# EAGLE design CAN-Bus (EAGLE 6.2)
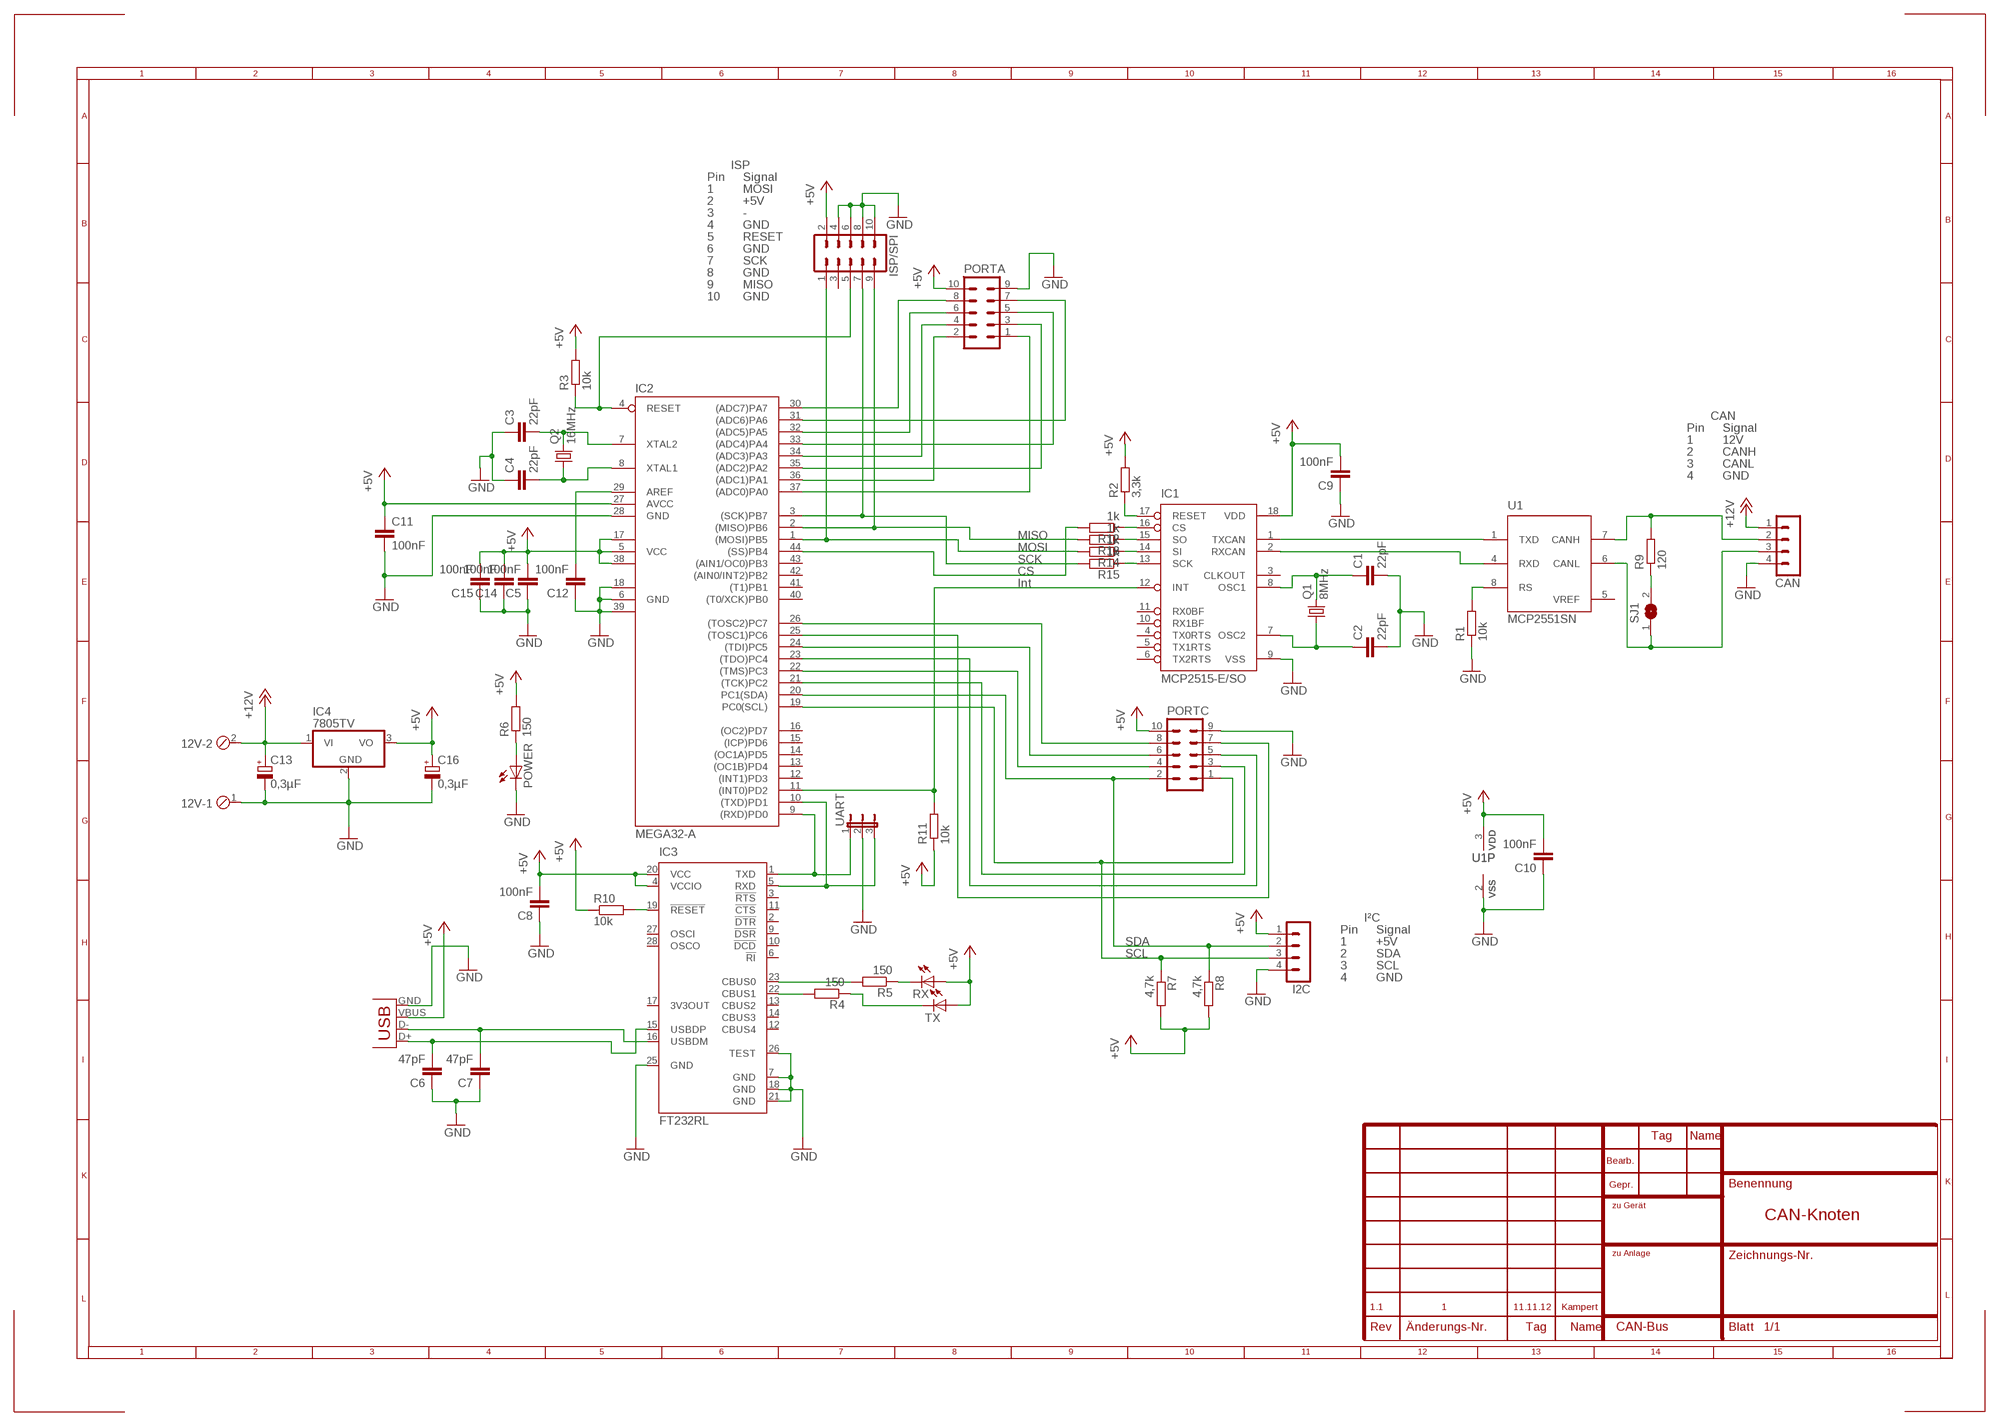
[diagram p0: schematic, sheet 1]

## Parts
12V  MPT2  [2POL254]
C1  22pF  C-EUC0805  [C0805]
C2  22pF  C-EUC0805  [C0805]
C3  22pF  C-EUC0805  [C0805]
C4  22pF  C-EUC0805  [C0805]
C5  100nF  C-EUC0805  [C0805]
C6  47pF  C-EUC0805  [C0805]
C7  47pF  C-EUC0805  [C0805]
C8  100nF  C-EUC0805  [C0805]
C9  100nF  C-EUC0805  [C0805]
C10  100nF  C-EUC0805  [C0805]
C11  100nF  C-EUC0805  [C0805]
C12  100nF  C-EUC0805  [C0805]
C13  0,3µF  CPOL-EU153CLV-0405  [153CLV-0405]
C14  100nF  C-EUC0805  [C0805]
C15  100nF  C-EUC0805  [C0805]
C16  0,3µF  CPOL-EU153CLV-0405  [153CLV-0405]
CAN  MA04-1  [MA04-1]
I2C  MA04-1  [MA04-1]
IC1  MCP2515-E/SO  [SO18L]
IC2  MEGA32-A  [TQFP44]
IC3  FT232RL  [SSOP28]
IC4  7805TV  [TO220V]
ISP/SPI  ML10  [ML10]
PORTA  ML10  [ML10]
PORTC  ML10  [ML10]
POWER  LEDCHIP-LED0805  [CHIP-LED0805]
Q1  8MHz  CRYSTALHC49UP  [HC49UP]
Q2  16MHz  CRYSTALHC49UP  [HC49UP]
R1  10k  R-EU_M0805  [M0805]
R2  3,3k  R-EU_M0805  [M0805]
R3  10k  R-EU_M0805  [M0805]
R4  150  R-EU_M0805  [M0805]
R5  150  R-EU_M0805  [M0805]
R6  150  R-EU_M0805  [M0805]
R7  4,7k  R-EU_M0805  [M0805]
R8  4,7k  R-EU_M0805  [M0805]
R9  120  R-EU_M0805  [M0805]
R10  10k  R-EU_M0805  [M0805]
R11  10k  R-EU_M0805  [M0805]
R12  1k  R-EU_R0402  [R0402]
R13  1k  R-EU_R0402  [R0402]
R14  1k  R-EU_R0402  [R0402]
R15  1k  R-EU_R0402  [R0402]
RX  LEDCHIP-LED0805  [CHIP-LED0805]
SJ1  SJ  [SJ]
TX  LEDCHIP-LED0805  [CHIP-LED0805]
U1  MCP2551SN  [SO-08]
UART  JP2E  [JP2]
X1  USB-B-H  [USB-B-H]

## Nets
+5V: C5.2 C8.2 C9.2 C10.2 C11.1 C14.2 C15.2 C16.+ I2C.1 IC1.18(VDD) IC2.5(VCC) IC2.17(VCC1) IC2.27(AVCC) IC2.38(VCC2) IC3.4(VCCIO) IC3.20(VCC) IC4.3(VO) ISP/SPI.2 PORTA.10 PORTC.10 R2.2 R3.2 R6.2 R7.2 R8.2 R10.1 R11.1 RX.A TX.A U1.3(VDD) X1.VBUS
+12V: 12V.2 C13.+ CAN.1 IC4.1(VI)
CANH: CAN.2 R9.2 U1.7(CANH)
CANL: CAN.3 SJ1.1 U1.6(CANL)
CHIPSELECT: IC2.44((SS)PB4) R12.2
D+: C6.2 IC3.15(USBDP) X1.D+
D-: C7.2 IC3.16(USBDM) X1.D-
GND: 12V.1 C1.2 C2.2 C3.1 C4.1 C5.1 C6.1 C7.1 C8.1 C9.1 C10.1 C11.2 C12.1 C13.- C14.1 C15.1 C16.- CAN.4 I2C.4 IC1.9(VSS) IC2.6(GND) IC2.18(GND1) IC2.28(GND) IC2.39(GND2) IC3.7(GND) IC3.18(GND) IC3.21(GND) IC3.25(GND) IC3.26(TEST) IC4.2(GND) ISP/SPI.4 ISP/SPI.6 ISP/SPI.8 ISP/SPI.10 PORTA.9 PORTC.9 POWER.C R1.1 U1.2(VSS) UART.2 X1.GND
MISO: IC2.2((MISO)PB6) ISP/SPI.9 R13.2
MOSI: IC2.1((MOSI)PB5) ISP/SPI.1 R14.2
N$4: C4.2 IC2.8(XTAL1) Q2.1
N$5: R1.2 U1.8(RS)
N$6: C3.2 IC2.7(XTAL2) Q2.2
N$7: IC3.23(CBUS0) R5.2
N$8: IC1.1(TXCAN) U1.1(TXD)
N$9: IC1.2(RXCAN) U1.4(RXD)
N$10: C2.1 IC1.7(OSC2) Q1.1
N$11: C1.1 IC1.8(OSC1) Q1.2
N$13: IC1.17(RESET) R2.1
N$15: R4.1 TX.C
N$16: R5.1 RX.C
N$17: IC3.22(CBUS1) R4.2
N$18: IC2.37((ADC0)PA0) PORTA.1
N$19: IC2.36((ADC1)PA1) PORTA.2
N$20: IC2.35((ADC2)PA2) PORTA.3
N$21: IC2.34((ADC3)PA3) PORTA.4
N$22: IC2.33((ADC4)PA4) PORTA.5
N$23: IC2.32((ADC5)PA5) PORTA.6
N$24: IC2.31((ADC6)PA6) PORTA.7
N$25: IC2.30((ADC7)PA7) PORTA.8
N$26: IC1.12(INT) IC2.11((INT0)PD2) R11.2
N$29: IC2.21((TCK)PC2) PORTC.3
N$30: IC2.22((TMS)PC3) PORTC.4
N$31: IC2.23((TDO)PC4) PORTC.5
N$32: IC2.24((TDI)PC5) PORTC.6
N$33: IC2.25((TOSC1)PC6) PORTC.7
N$34: IC2.26((TOSC2)PC7) PORTC.8
N$35: POWER.A R6.1
N$37: IC3.19(!RESET) R10.2
N$38: C12.2 IC2.29(AREF)
N$39: R9.1 SJ1.2
N$40: IC1.13(SCK) R15.1
N$41: IC1.14(SI) R14.1
N$42: IC1.15(SO) R13.1
N$43: IC1.16(CS) R12.1
RESET: IC2.4(RESET) ISP/SPI.5 R3.1
RX: IC2.9((RXD)PD0) IC3.1(TXD) UART.1
SCK: IC2.3((SCK)PB7) ISP/SPI.7 R15.2
SCL: I2C.3 IC2.19(PC0(SCL)) PORTC.1 R7.1
SDA: I2C.2 IC2.20(PC1(SDA)) PORTC.2 R8.1
TX: IC2.10((TXD)PD1) IC3.5(RXD) UART.3
Unconnected: IC1.3(CLKOUT) IC1.4(TX0RTS) IC1.5(TX1RTS) IC1.6(TX2RTS) IC1.10(RX1BF) IC1.11(RX0BF) IC2.12((INT1)PD3) IC2.13((OC1B)PD4) IC2.14((OC1A)PD5) IC2.15((ICP)PD6) IC2.16((OC2)PD7) IC2.40((T0/XCK)PB0) IC2.41((T1)PB1) IC2.42((AIN0/INT2)PB2) IC2.43((AIN1/OC0)PB3) IC3.2(!DTR) IC3.3(!RTS) IC3.6(!RI) IC3.9(!DSR) IC3.10(!DCD) IC3.11(!CTS) IC3.12(CBUS4) IC3.13(CBUS2) IC3.14(CBUS3) IC3.17(3V3OUT) IC3.27(OSCI) IC3.28(OSCO) ISP/SPI.3

## Notes on the sheet
- ISP
- Pin | Signal
- 1 | MOSI
- 2 | +5V
- 3 | -
- 4 | GND
- 5 | RESET
- 6 | GND
- 7 | SCK
- 8 | GND
- 9 | MISO
- 10 | GND
- CAN
- Pin | Signal
- 1 | 12V
- 2 | CANH
- 3 | CANL
- 4 | GND
- MISO
- MOSI
- SCK
- CS
- Int
- I²C
- Pin | Signal
- SDA | 1 | +5V
- SCL | 2 | SDA
- 3 | SCL
- 4 | GND
- CAN-Knoten
- 1.1 | 1 | 11.11.12 | Kampert

## Power pins joined to a net without a drawn wire
VREF: U1.5(VREF)

## Library data of the parts
12V = con-phoenix-254:MPT2: PHOENIX CONNECTOR; OC_FARNELL: unknown; OC_NEWARK: unknown
C1-C12 C14 C15 = rcl:C-EU: CAPACITOR, European symbol
C13 C16 = rcl:CPOL-EU: POLARIZED CAPACITOR, European symbol
CAN I2C = con-lstb:MA04-1: PIN HEADER; OC_FARNELL: unknown; OC_NEWARK: unknown
IC1 = mcp2515:MCP2515
IC2 = atmel:MEGA32: MICROCONTROLLER 32 Kbytes FLASH 2 Kbytes SRAM 1 Kbytes EEPROM USART 8-channel 10 bit ADC Source: www.atmel.com .. doc2503.pdf; MPN: ATMEGA32-16AU; OC_FARNELL: 9171274; OC_NEWARK: 69K6677
IC3 = ftdichip:FT232R: Source: http://www.ftdichip.com/Documents/DataSheets/DS_FT232R_v104.pdf; MPN: FT232RL; OC_FARNELL: 1146032; OC_NEWARK: 91K9918
IC4 = linear:78*: Positive VOLTAGE REGULATOR Source: http://cache.national.com/ds/LM/LM78L05.pdf http://www.fairchildsemi.com/ds/LM/LM7805.pdf
ISP/SPI PORTA PORTC = con-harting-ml:ML10: HARTING; OC_FARNELL: unknown; OC_NEWARK: unknown
POWER RX TX = led:LED: LED OSRAM: - CHIPLED LG R971, LG N971, LY N971, LG Q971, LY Q971, LO R971, LY R971 LH N974, LH R974 LS Q976, LO Q976, LY Q976 LO Q996 - Hyper CHIPLED LW Q18S LB Q993, LB Q99A, LB R99A - SideLED LS A670, LO A670, LY A670, LG A670, LP A670 LB A673, LV A673, LT A673, LW A673 LH A674 LY A675 LS A676, LA A676, LO A676, LY A676, LW A676 LS A679, LY A679, LG A679 - Hyper Micro SIDELED® LS Y876, LA Y876, LO Y876, LY Y876 LT Y87S - SmartLED LW L88C, LW L88S LB L89C, LB L89S, LG L890 LS L89K, LO L89K, LY L89K LS L896, LA L896, LO L896, LY L896 - TOPLED LS T670, LO T670, LY T670, LG T670, LP T670 LSG T670, LSP T670, LSY T670, LOP T670, LYG T670 LG T671, LOG T671, LSG T671 LB T673, LV T673, LT T673, LW T673 LH T674 LS T676, LA T676, LO T676, LY T676, LB T676, LH T676, LSB T676, LW T676 LB T67C, LV T67C, LT T67C, LS T67K, LO T67K, LY T67K, LW E67C LS E67B, LA E67B, LO E67B, LY E67B, LB E67C, LV E67C, LT E67C LW T67C LS T679, LY T679, LG T679 LS T770, LO T770, LY T770, LG T770, LP T770 LB T773, LV T773, LT T773, LW T773 LH T774 LS E675, LA E675, LY E675, LS T675 LS T776, LA T776, LO T776, LY T776, LB T776 LHGB T686 LT T68C, LB T68C - Hyper Mini TOPLED® LB M676 - Mini TOPLED Santana® LG M470 LS M47K, LO M47K, LY M47K Source: http://www.osram.convergy.de LUXEON: - LUMILED® LXK2-PW12-R00, LXK2-PW12-S00, LXK2-PW14-U00, LXK2-PW14-V00 LXK2-PM12-R00, LXK2-PM12-S00, LXK2-PM14-U00 LXK2-PE12-Q00, LXK2-PE12-R00, LXK2-PE12-S00, LXK2-PE14-T00, LXK2-PE14-U00 LXK2-PB12-K00, LXK2-PB12-L00, LXK2-PB12-M00, LXK2-PB14-N00, LXK2-PB14-P00, LXK2-PB14-Q00 LXK2-PR12-L00, LXK2-PR12-M00, LXK2-PR14-Q00, LXK2-PR14-R00 LXK2-PD12-Q00, LXK2-PD12-R00, LXK2-PD12-S00 LXK2-PH12-R00, LXK2-PH12-S00 LXK2-PL12-P00, LXK2-PL12-Q00, LXK2-PL12-R00 Source: www.luxeon.com KINGBRIGHT: KA-3528ASYC Source: www.kingbright.com
Q1 Q2 = crystal:CRYSTAL: CRYSTAL; OC_FARNELL: unknown; OC_NEWARK: unknown
R1-R15 = rcl:R-EU_: RESISTOR, European symbol
SJ1 = jumper:SJ: SMD solder JUMPER
U1 = microchip_can:MCP2551: High Speed CAN tranceiver
UART = jumper:JP2E: JUMPER
X1 = con-usb:USB: USB Connectors

## Board
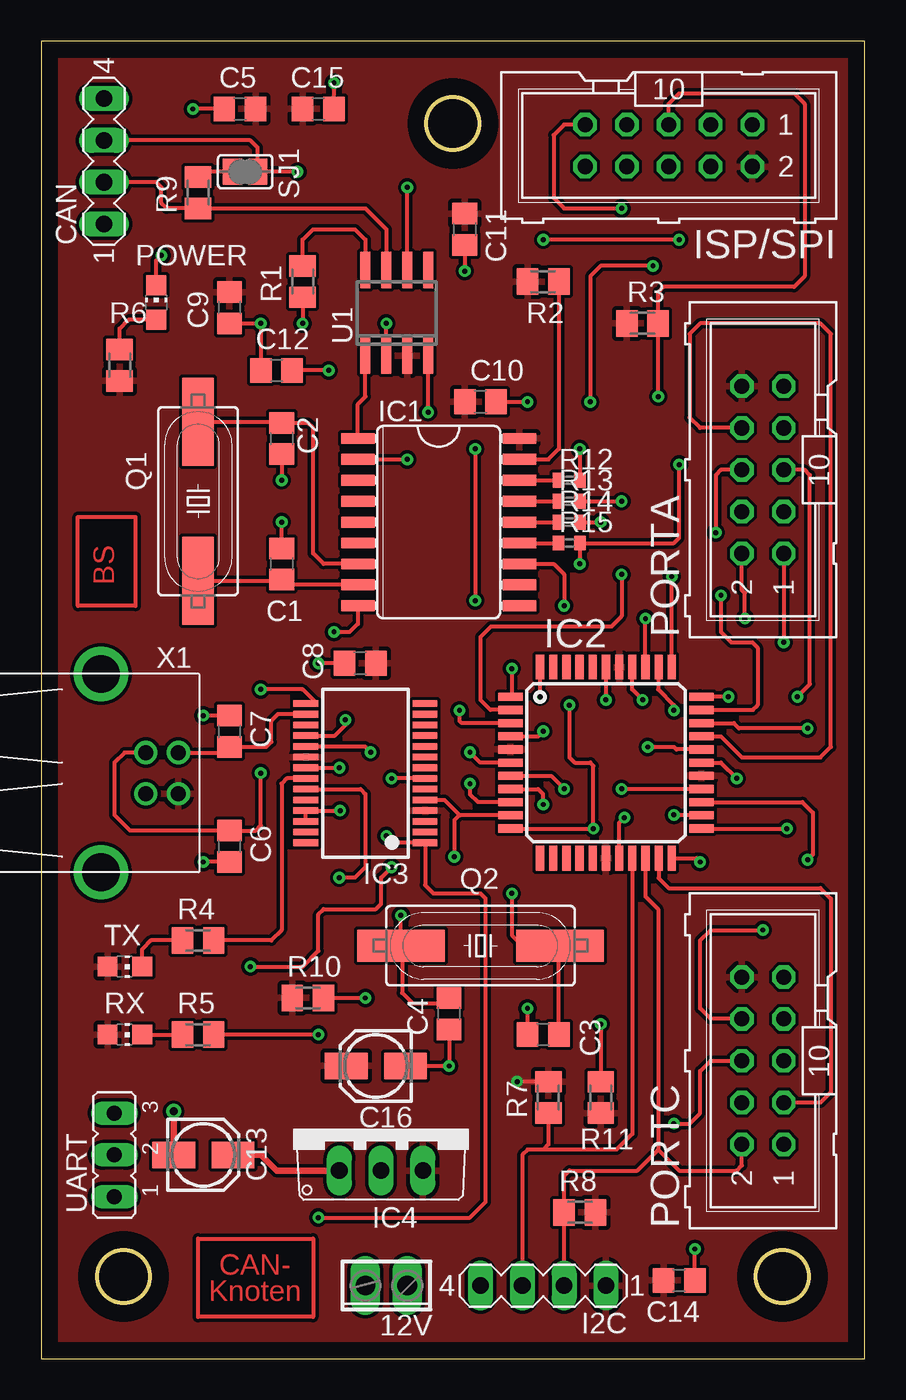
[diagram p1: board, top side]
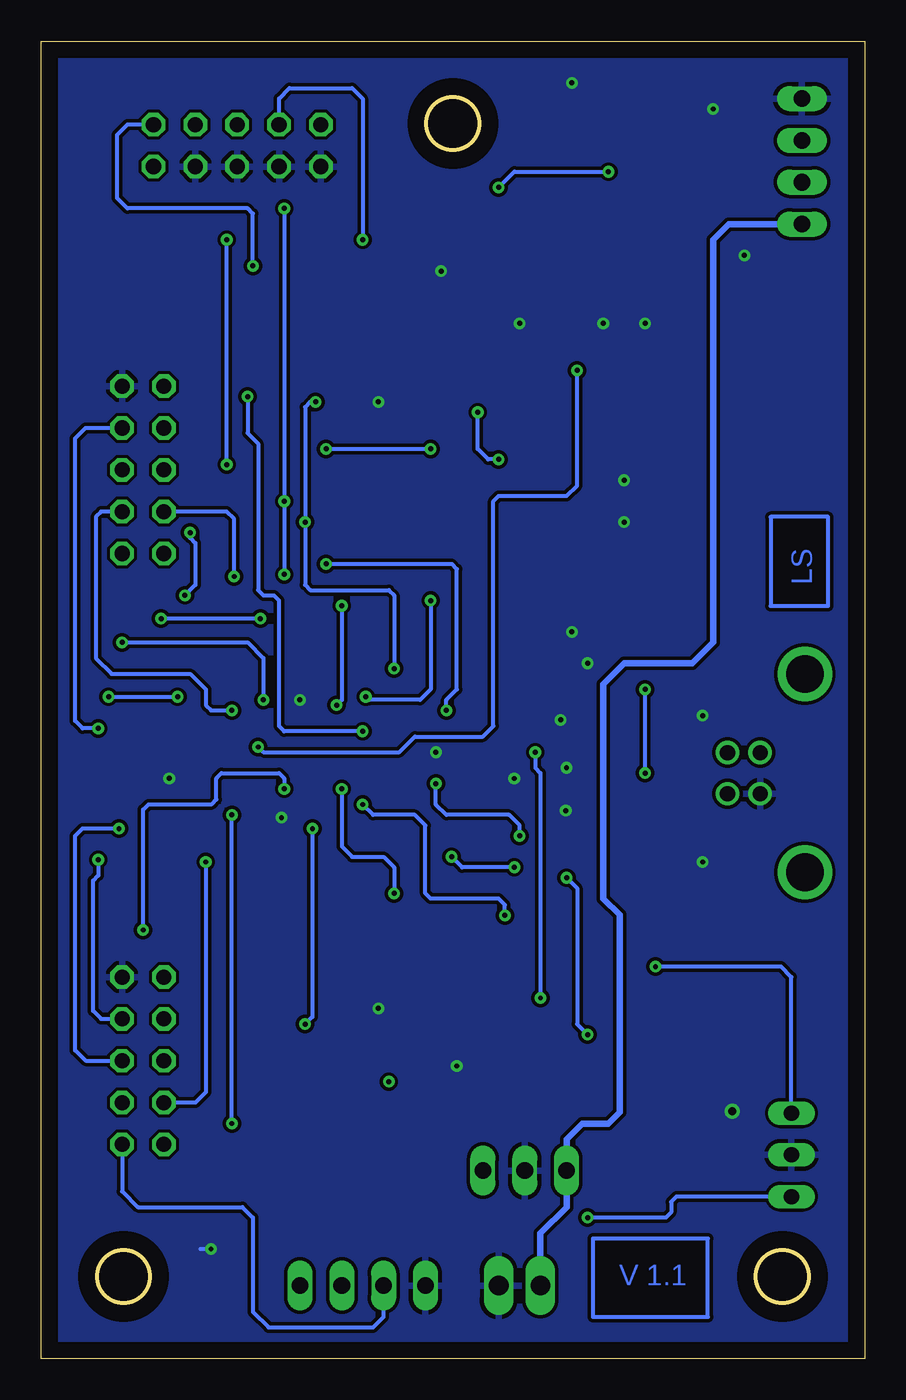
[diagram p2: board, bottom side, seen from below]

Size 50 x 80 mm. Coordinates in mm from the lower left corner, seen from the top.
Outline: 0,0 50,0 50,80 0,80 0,0
Outline: circle at 45,5 radius 1.6
Outline: circle at 5,5 radius 1.6
Outline: circle at 25,75 radius 1.6
Copper layers (1*16): Top 0.035mm / dielectric 1.5mm / Bottom 0.035mm
Design rules: minimum track width 10mil, minimum drill 24mil, track to track 8mil, track to pad 8mil, pad to pad 8mil, via to via 8mil, smd to smd 8mil, copper to edge 40mil, drill to drill 8mil, minimum pad ring 10mil, minimum via ring 8mil, stop-mask expansion 4mil, vias tented up to drill 0mil, thermal gap 10mil

### Footprints (pad centres in the part's own frame; a part is rotated, then mirrored left to right if it is on the bottom)
2POL254 = drill 1.2 long: 1 -1.27,0; 2 1.27,0
C0805 = smd 1.3 x 1.5: 1 -0.95,0; 2 0.95,0
153CLV-0405 = smd 2.6 x 1.6: + 1.8,0; - -1.8,0
MA04-1 = drill 1.016 long: 1 -3.81,0; 2 -1.27,0; 3 1.27,0; 4 3.81,0
SO18L = smd 0.66 x 2.032: 1 -5.08,-4.902; 2 -3.81,-4.902; 3 -2.54,-4.902; 4 -1.27,-4.902; 5 0,-4.902; 6 1.27,-4.902; 7 2.54,-4.902; 8 3.81,-4.902; 9 5.08,-4.902; 10 5.08,4.902; 11 3.81,4.902; 12 2.54,4.902; 13 1.27,4.902; 14 0,4.902; 15 -1.27,4.902; 16 -2.54,4.902; 17 -3.81,4.902; 18 -5.08,4.902
TQFP44 = smd 1.5 x 0.5: 1 -5.8,4; 2 -5.8,3.2; 3 -5.8,2.4; 4 -5.8,1.6; 5 -5.8,0.8; 6 -5.8,0; 7 -5.8,-0.8; 8 -5.8,-1.6; 9 -5.8,-2.4; 10 -5.8,-3.2; 11 -5.8,-4; 23 5.8,-4; 24 5.8,-3.2; 25 5.8,-2.4; 26 5.8,-1.6; 27 5.8,-0.8; 28 5.8,0; 29 5.8,0.8; 30 5.8,1.6; 31 5.8,2.4; 32 5.8,3.2; 33 5.8,4 | smd 0.5 x 1.5: 12 -4,-5.8; 13 -3.2,-5.8; 14 -2.4,-5.8; 15 -1.6,-5.8; 16 -0.8,-5.8; 17 0,-5.8; 18 0.8,-5.8; 19 1.6,-5.8; 20 2.4,-5.8; 21 3.2,-5.8; 22 4,-5.8; 34 4,5.8; 35 3.2,5.8; 36 2.4,5.8; 37 1.6,5.8; 38 0.8,5.8; 39 0,5.8; 40 -0.8,5.8; 41 -1.6,5.8; 42 -2.4,5.8; 43 -3.2,5.8; 44 -4,5.8
SSOP28 = smd 0.4 x 1.5: 1 -4.225,-3.625; 2 -3.575,-3.625; 3 -2.925,-3.625; 4 -2.275,-3.625; 5 -1.625,-3.625; 6 -0.975,-3.625; 7 -0.325,-3.625; 8 0.325,-3.625; 9 0.975,-3.625; 10 1.625,-3.625; 11 2.275,-3.625; 12 2.925,-3.625; 13 3.575,-3.625; 14 4.225,-3.625; 15 4.225,3.625; 16 3.575,3.625; 17 2.925,3.625; 18 2.275,3.625; 19 1.625,3.625; 20 0.975,3.625; 21 0.325,3.625; 22 -0.325,3.625; 23 -0.975,3.625; 24 -1.625,3.625; 25 -2.275,3.625; 26 -2.925,3.625; 27 -3.575,3.625; 28 -4.225,3.625
TO220V = drill 1.016 long: 1 -2.54,-2.54; 2 0,-2.54; 3 2.54,-2.54
ML10 = drill 0.914 octagon: 1 -5.08,-1.27; 2 -5.08,1.27; 3 -2.54,-1.27; 4 -2.54,1.27; 5 0,-1.27; 6 0,1.27; 7 2.54,-1.27; 8 2.54,1.27; 9 5.08,-1.27; 10 5.08,1.27
CHIP-LED0805 = smd 1.2 x 1.2: A 0,-1.05; C 0,1.05
HC49UP = smd 5.334 x 1.93: 1 -4.826,0; 2 4.826,0
M0805 = smd 1.3 x 1.6: 1 -0.95,0; 2 0.95,0
R0402 = smd 0.7 x 0.9: 1 -0.65,0; 2 0.65,0
SJ = smd 1.168 x 1.6: 1 -0.762,0; 2 0.762,0
SO-08 = smd 0.6 x 2.2: 1 -1.905,-2.6; 2 -0.635,-2.6; 3 0.635,-2.6; 4 1.905,-2.6; 5 1.905,2.6; 6 0.635,2.6; 7 -0.635,2.6; 8 -1.905,2.6
JP2 = drill 0.914 long: 1 -2.54,0; 2 0,0; 3 2.54,0
USB-B-H = drill 0.914: D+ 0,1.25; D- 1.981,1.25; GND 0,-1.25; VBUS 1.981,-1.25 | drill 2.286: P$1 -2.718,-6.02; P$2 -2.718,6.02

### Placement (x,y rotation side)
12V  20.95,4.45 180 top
C1  14.61,48.26 90 top
C2  14.61,55.88 270 top
C3  30.48,19.68 0 top
C4  24.77,20.95 90 top
C5  12.06,75.88 0 top
C6  11.43,31.11 90 top
C7  11.43,38.1 270 top
C8  19.37,42.23 0 top
C9  11.43,63.82 90 top
C10  26.67,58.1 180 top
C11  25.72,68.58 270 top
C12  14.29,60.01 0 top
C13  9.84,12.38 0 top
C14  38.73,4.76 180 top
C15  16.83,75.88 180 top
C16  20.32,17.78 180 top
CAN  3.81,72.71 90 top
I2C  30.48,4.45 180 top
IC1  24.13,50.8 270 top
IC2  34.29,36.2 0 top
IC3  19.68,35.56 90 top
IC4  20.64,13.97 0 top
ISP/SPI  38.1,73.66 180 top
PORTA  43.81,53.98 90 top
PORTC  43.81,18.1 90 top
POWER  6.99,64.14 0 top
Q1  9.53,52.07 270 top
Q2  26.67,25.08 0 top
R1  15.88,65.41 90 top
R2  30.48,65.41 180 top
R3  36.51,62.87 180 top
R4  9.53,25.4 0 top
R5  9.53,19.68 0 top
R6  4.76,60.33 270 top
R7  30.8,15.88 90 top
R8  32.7,8.89 0 top
R9  9.53,70.8 270 top
R10  16.19,21.91 0 top
R11  33.97,15.88 90 top
R12  32.07,53.34 0 top
R13  32.07,52.07 0 top
R14  32.07,50.8 0 top
R15  32.07,49.53 0 top
RX  5.08,19.68 270 top
SJ1  12.38,72.07 180 top
TX  5.08,23.81 270 top
U1  21.59,63.5 0 top
UART  4.45,12.38 90 top
X1  6.35,35.56 0 top

### Tracks (layer width: path | path; a pad name or v marks a point on that pad's centre or on a via)
+5V  (via drill 0.3)
  Top 0.254: R7.2 v28.89,16.82 v28.89,16.83
  pour Top: -6.35,87.63 105.41,87.63 105.41,-11.43 -6.35,-11.43
+12V
  Top 0.254: 11.43,12.38 C13.+ 11.75,12.38
  Top 0.406: IC4.1 14.29,11.43 13.34,12.38 11.75,12.38
  Bottom 0.406: CAN.1 8.26,68.9 9.21,67.94 9.21,43.5 10.48,42.23 14.61,42.23 15.88,40.96 15.88,27.94 14.88,26.95 14.88,14.96 15.56,14.29 17.14,14.29 18.1,13.34 IC4.1 18.1,9.21 19.68,7.62 12V.2
CANH
  Top 0.254: U1.7 20.95,68.58 19.69,69.85 R9.2 7.62,69.85 7.3,70.17 7.3,71.12 6.99,71.44 CAN.2
CANL  (via drill 0.3)
  Top 0.254: CAN.3 12.7,73.98 13.14,73.53 SJ1.1 v15.56,72.07 | U1.6 v22.23,71.12
  Bottom 0.254: v22.23,71.12 21.27,72.07 v15.56,72.07
CHIPSELECT  (via drill 0.3)
  Top 0.254: R12.2 32.72,55.23 v32.7,55.24 | v26.35,55.24 v26.35,46.04 | v30.29,40.2 30.29,41.78 30.16,41.91 30.25,41.99 IC2.44
  Bottom 0.254: v32.7,55.24 v26.35,55.24 | v26.35,46.04 26.35,40.64 26.99,40.01 30.1,40.01 v30.29,40.2
D+  (via drill 0.3)
  Top 0.254: X1.D+ 5.06,36.81 4.45,36.2 4.45,33.02 5.4,32.06 C6.2 13.02,32.06 13.34,32.38 v13.34,35.56 | IC3.15 16.7,39.82 15.88,40.64 v13.34,40.64
  Bottom 0.254: v13.34,35.56 v13.34,40.64
D-
  Top 0.254: X1.D- 11.09,36.81 C7.2 13.65,37.15 13.97,37.47 13.97,38.73 14.37,39.13 IC3.16
GND  (via drill 0.3, 0.5)
  Top 0.254: v18.15,33.28 IC3.25 IC3.26 | C7.1 v9.85,39.05 | C6.1 v9.85,30.16 | 6.99,64.77 POWER.C 6.99,66.67 v7.3,66.99 | IC3.21 v18.11,35.88 | IC3.7 v21.28,35.23 | C1.2 v14.61,50.8 | C2.2 v14.61,53.34 | C8.1 v16.83,42.23 | C5.1 v9.21,75.88 | U1.2 v20.95,62.87 | R1.1 v15.88,62.87 | C4.1 24.76,19.68 v24.77,17.78 C16.- | C3.1 v29.53,21.27 | IC2.39 v34.29,40.01 | IC2.6 26.67,36.2 v26.04,36.83 | IC3.18 17.83,37.84 18.47,38.47 v18.47,38.79 | IC2.28 41.27,36.2 v42.23,35.24 | C9.1 v13.33,62.87 C12.1 | C10.1 v29.53,58.1 | C11.2 v25.72,66.04 | v17.78,44.13 18.73,44.13 19.23,44.63 IC1.9 | IC2.18 35.09,32.54 v35.41,32.85 | C15.1 v17.78,77.47 | C14.1 v39.69,6.67
  Top 0.406: C13.- v8.04,15.03
  Bottom 0.254: v39.69,6.67 40.32,6.67
  pour Bottom: -6.35,88.9 106.68,88.9 106.68,-12.7 -6.35,-12.7
MISO  (via drill 0.3)
  Top 0.254: R13.2 v35.24,52.07 | v35.24,47.62 35.24,45.09 34.61,44.45 27.3,44.45 26.67,43.81 26.67,40.01 27.28,39.4 IC2.2 | ISP/SPI.9 31.75,74.93 31.11,74.3 31.11,70.48 31.75,69.85 v35.24,69.85
  Bottom 0.254: v35.24,47.62 v35.24,52.07 v35.24,69.85
MOSI  (via drill 0.3)
  Top 0.254: R14.2 v33.97,50.8 | v28.57,41.91 28.57,40.28 IC2.1 | v37.15,66.36 33.97,66.36 33.34,65.72 v33.34,58.1
  Bottom 0.254: v28.57,41.91 28.57,46.35 28.89,46.67 33.66,46.67 33.97,46.99 v33.97,50.8 33.97,57.78 33.66,58.1 v33.34,58.1 | ISP/SPI.1 44.77,74.93 45.4,74.3 45.4,70.48 44.77,69.85 37.47,69.85 37.15,69.53 v37.15,66.36
N$1
  Top 0.254: 2.22,45.72 2.22,51.12 5.71,51.12 5.71,45.72 2.22,45.72
N$2
  Bottom 0.254: 2.22,45.72 2.22,51.12 5.71,51.12 5.71,45.72 2.22,45.72
N$3
  Bottom 0.254: 9.53,7.3 16.51,7.3 16.51,2.54 9.53,2.54 9.53,7.3
N$4  (via drill 0.3)
  Top 0.254: v21.84,26.92 Q2.1 21.91,25.02 21.91,22.22 22.55,21.59 24.45,21.59 C4.2 | v30.48,33.66 30.48,34.29 30.18,34.59 IC2.8
  Bottom 0.254: v30.48,33.66 29.84,33.02 27.3,33.02 26.67,32.38 26.67,28.26 26.35,27.94 22.23,27.94 21.84,27.56 v21.84,26.92
N$5
  Top 0.254: R1.2 15.88,67.94 16.51,68.58 19.05,68.58 19.68,67.94 U1.8 19.68,66.04
N$6  (via drill 0.3)
  Top 0.254: C3.2 31.43,25.02 Q2.2 29.21,25.08 28.57,25.72 v28.57,28.26 | IC2.7 30.96,35.4 v31.75,34.61
  Bottom 0.254: v31.75,34.61 31.75,31.11 31.11,30.48 29.21,30.48 28.57,29.84 v28.57,28.26
N$7  (via drill 0.3)
  Top 0.254: IC3.23 19.39,34.59 19.68,34.29 19.68,29.84 19.05,29.21 v18.1,29.21 | v16.83,19.68 R5.2
  Bottom 0.254: v18.1,29.21 17.46,28.57 17.46,20.32 v16.83,19.68
N$8
  Top 0.254: IC1.1 19.23,57.96 19.68,58.42 U1.1 19.68,60.96
N$9  (via drill 0.3)
  Top 0.254: IC1.2 v22.23,54.61 | v23.5,57.47 U1.4
  Bottom 0.254: v22.23,54.61 22.86,54.61 23.5,55.24 v23.5,57.47
N$10
  Top 0.254: Q1.1 14.99,56.9 14.61,56.52 C2.1 16.2,56.83 16.51,56.52 16.51,48.9 17.14,48.26 IC1.7
N$11
  Top 0.254: Q1.2 14.67,47.24 C1.1 14.61,46.99 IC1.8
N$13
  Top 0.254: IC1.17 30.8,54.61 31.43,55.24 31.43,62.87 | R2.1 31.43,62.87 | 31.43,62.87
N$15
  Top 0.254: R4.1 6.67,25.4 6.13,24.86 TX.C
N$16
  Top 0.254: RX.C R5.1
N$17
  Top 0.254: IC3.22 14.91,35.23 14.61,34.92 14.61,26.04 13.97,25.4 R4.2 10.79,25.4
N$18  (via drill 0.3)
  Top 0.254: PORTA.1 v45.09,43.5 | v36.51,40.01 35.88,40.64 35.88,41.91 35.89,41.92 IC2.37
  Bottom 0.254: v45.09,43.5 37.47,43.5 36.51,42.55 v36.51,40.01
N$19  (via drill 0.3)
  Top 0.254: IC2.36 v36.69,44.95 | v42.72,44.95 42.72,46.49 42.55,46.67 PORTA.2
  Bottom 0.254: v36.69,44.95 v42.72,44.95
N$20  (via drill 0.3)
  Top 0.254: IC2.35 37.49,41.94 37.47,41.91 37.47,40.64 38.42,39.69 v38.42,39.37
  Bottom 0.254: PORTA.3 46.35,51.44 46.67,51.12 46.67,42.55 45.72,41.59 40.96,41.59 40.01,40.64 40.01,39.69 39.69,39.37 v38.42,39.37
N$21  (via drill 0.3)
  Top 0.254: IC2.34 v38.29,47.5
  Bottom 0.254: PORTA.4 38.73,51.44 38.29,50.99 v38.29,47.5
N$22  (via drill 0.3)
  Top 0.254: v45.91,40.2 46.67,40.96 46.67,53.66 46.35,53.98 PORTA.5 | v41.72,40.2 40.13,40.2 | 40.13,40.2 40.01,40.32 | 40.13,40.2 IC2.33
  Bottom 0.254: v45.91,40.2 v41.72,40.2
N$23  (via drill 0.3)
  Top 0.254: PORTA.6 41.27,53.98 40.96,53.66 v40.96,50.16 | v41.27,46.35 41.27,44.13 41.91,43.5 43.18,43.5 43.5,43.18 43.5,39.69 43.2,39.4 IC2.32
  Bottom 0.254: v40.96,50.16 40.96,49.85 40.64,49.53 40.64,46.99 v41.27,46.35
N$24  (via drill 0.3)
  Top 0.254: IC2.31 42.05,38.59 42.37,38.28 v46.53,38.28
  Bottom 0.254: PORTA.7 47.31,56.52 47.94,55.88 47.94,38.73 47.48,38.28 v46.53,38.28
N$25
  Top 0.254: IC2.30 41.26,37.8 42.55,36.51 47.31,36.51 47.94,37.15 47.94,62.23 47.31,62.87 40.01,62.87 39.37,62.23 39.37,57.15 40.01,56.52 PORTA.8
N$26  (via drill 0.3)
  Top 0.254: IC2.11 v33.53,32.2 33.53,36.01 33.34,36.2 32.38,36.2 32.07,36.51 v32.07,39.69 | v33.97,20.32 R11.2 | IC1.12 31.11,48.26 31.75,47.62 v31.75,45.72
  Bottom 0.254: v33.53,32.2 33.53,20.77 v33.97,20.32 | v31.75,45.72 31.75,40.01 v32.07,39.69
N$29
  Top 0.254: IC2.21 37.49,29.18 38.1,28.57 47.31,28.57 47.94,27.94 47.94,16.19 47.31,15.56 PORTC.3
N$30  (via drill 0.3)
  Top 0.254: v40.01,30.16 39.77,30.39 IC2.22
  Bottom 0.254: v40.01,30.16 40.01,16.19 40.64,15.56 PORTC.4
N$31  (via drill 0.3)
  Top 0.254: IC2.23 v45.27,32.2
  Bottom 0.254: v45.27,32.2 47.5,32.2 47.94,31.75 47.94,18.73 47.31,18.1 PORTC.5
N$32  (via drill 0.3)
  Top 0.254: v38.42,14.29 39.37,14.29 40.01,14.92 40.01,17.46 40.64,18.1 PORTC.6 | v38.42,33.02 40.06,33.02 IC2.24
  Bottom 0.254: v38.42,14.29 v38.42,33.02
N$33  (via drill 0.3)
  Top 0.254: IC2.25 46.22,33.8 46.85,33.16 46.85,30.62 v46.53,30.3 46.53,30.34 46.67,30.48
  Bottom 0.254: PORTC.7 46.35,20.64 46.85,21.13 46.85,29.03 46.53,29.35 v46.53,30.3
N$34  (via drill 0.3)
  Top 0.254: PORTC.8 40.64,20.64 40.01,21.27 40.01,25.4 40.64,26.04 v43.81,26.04 | IC2.26 35.26,34.59 v35.24,34.61
  Bottom 0.254: v43.81,26.04 43.81,33.34 43.5,33.66 39.69,33.66 39.37,33.97 39.37,35.24 39.05,35.56 35.56,35.56 35.24,35.24 v35.24,34.61
N$35
  Top 0.254: R6.1 4.76,62.55 5.3,63.09 POWER.A
N$36
  Top 0.254: 9.53,2.54 9.53,7.3 16.51,7.3 16.51,2.54 9.53,2.54
N$37  (via drill 0.3)
  Top 0.254: IC3.19 19.65,37.19 v20,36.83 | R10.2 v19.68,21.91
  Bottom 0.254: v20,36.83 20,35.88 19.68,35.56 v19.68,21.91
N$38  (via drill 0.3)
  Top 0.254: v17.46,60.01 C12.2 | v36.83,37.15 38.42,37.15 38.57,36.99 IC2.29
  Bottom 0.254: v17.46,60.01 17.46,53.02 18.1,52.39 22.23,52.39 22.54,52.07 22.54,38.42 23.18,37.78 27.3,37.78 28.26,36.83 36.51,36.83 v36.83,37.15
N$39
  Top 0.254: SJ1.2 9.84,72.07 R9.1
N$40
  Top 0.254: IC1.13 R15.1
N$41
  Top 0.254: IC1.14 R14.1
N$42
  Top 0.254: IC1.15 R13.1
N$43
  Top 0.254: IC1.16 R12.1 31.43,53.34
RESET  (via drill 0.3)
  Top 0.254: ISP/SPI.5 38.1,76.2 38.73,76.83 45.72,76.83 46.35,76.2 46.35,65.72 45.72,65.09 37.78,65.09 37.46,64.77 R3.1 v37.47,58.42 | IC2.4 30.18,37.8 v30.48,38.1
  Bottom 0.254: v37.47,58.42 37.47,56.2 36.83,55.56 36.83,46.67 36.51,46.35 35.88,46.35 35.56,46.04 35.56,38.42 35.24,38.1 v30.48,38.1
RX  (via drill 0.3)
  Top 0.254: v20.95,31.75 21.37,31.34 IC3.1 23.31,28.76 23.81,28.26 26.67,28.26 26.99,27.94 26.99,9.53 26.04,8.57 v16.83,8.57 | v26.04,34.92 26.04,34.29 26.53,33.8 IC2.9
  Bottom 0.254: v20.95,31.75 20.95,32.38 21.59,33.02 25.4,33.02 26.04,33.66 v26.04,34.92 | UART.1 11.43,9.84 11.75,9.53 11.75,8.89 12.06,8.57 v16.83,8.57
SCK  (via drill 0.3)
  Top 0.254: v32.7,48.26 32.7,49.53 R15.2 38.42,49.53 38.73,49.85 v38.73,54.29 | IC2.3 25.54,38.59 25.4,38.73 v25.4,39.37 | v38.73,67.94 v30.48,67.94
  Bottom 0.254: v32.7,48.26 25.08,48.26 24.77,47.94 24.77,40.64 25.4,40.01 v25.4,39.37 | ISP/SPI.7 35.56,76.52 34.92,77.15 31.11,77.15 30.48,76.52 v30.48,67.94 | v38.73,54.29 v38.73,67.94
SCL
  Top 0.254: IC2.19 35.89,13.66 34.92,12.7 30.48,12.7 | 30.48,12.7 29.53,12.7 29.21,12.38 I2C.3 | R7.1 30.8,13.02 30.48,12.7
  Bottom 0.254: I2C.3 29.21,2.54 29.84,1.91 36.2,1.91 37.15,2.86 37.15,8.57 37.78,9.21 44.13,9.21 45.09,10.16 PORTC.1
SDA
  Top 0.254: 37.47,12.7 36.2,11.43 32.07,11.43 31.75,11.12 R8.1 I2C.2 | IC2.20 36.69,28.08 37.47,27.3 37.47,12.7 | 37.47,12.7 38.73,11.43 42.23,11.43 42.55,11.75 PORTC.2
TX  (via drill 0.3)
  Top 0.254: IC3.5 24.48,33.94 25.43,32.99 | IC2.10 25.43,32.99 | v12.7,23.81 15.88,23.81 16.83,24.77 16.83,26.99 17.14,27.3 20.32,27.3 20.64,27.62 20.64,29.21 v21.27,29.84 | 25.43,32.99 25.38,32.99 25.08,32.7 v25.08,30.48
  Bottom 0.254: UART.3 4.45,23.18 5.08,23.81 v12.7,23.81 | v21.27,29.84 24.45,29.84 v25.08,30.48

### Text on the board
Top: BS | CAN- | Knoten
Bottom: LS | V 1.1
tDocu: 1 | 1 | 1 | 1